# EAGLE design soic8 (EAGLE 7.7.0)
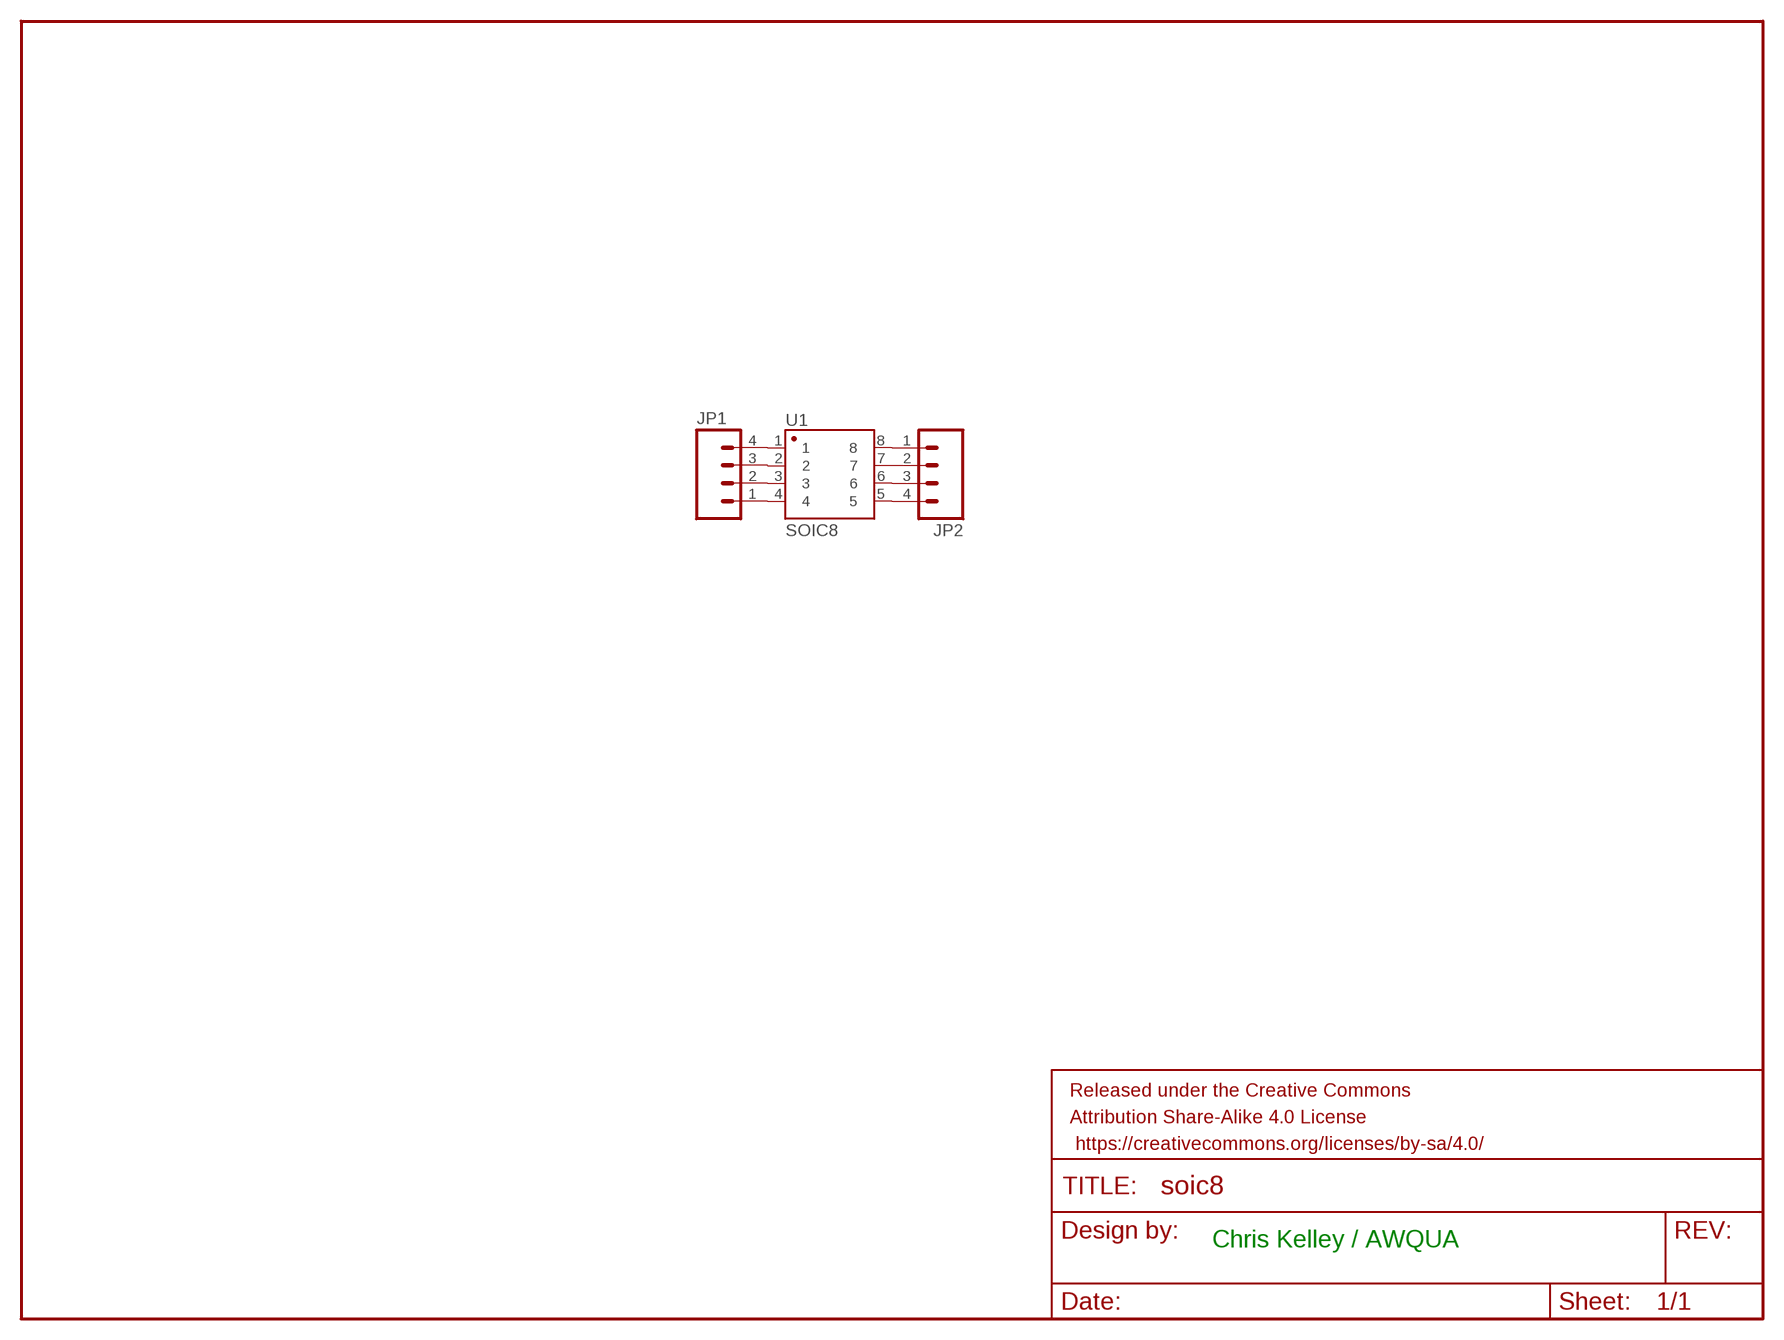
[diagram p0: schematic, sheet 1]

## Parts
FRAME1  FRAME-LETTER  [CREATIVE_COMMONS]
JP1  M04PTH  [1X04]
JP2  M04PTH  [1X04]
U1  SOIC8  GENERIC-SOIC8  [SO08-UNIVERSAL]

## Nets
N$1: JP1.1 U1.4
N$2: JP1.2 U1.3
N$3: JP1.3 U1.2
N$4: JP1.4 U1.1
N$5: JP2.1 U1.8
N$6: JP2.2 U1.7
N$7: JP2.3 U1.6
N$8: JP2.4 U1.5

## Notes on the sheet
- Chris Kelley / AWQUA

## Library data of the parts
FRAME1 = SparkFun-Aesthetics:FRAME-LETTER: Schematic Frame Standard 8.5x11 US Letter frame
JP1 JP2 = SparkFun-Connectors:M04: Header 4 Standard 4-pin 0.1" header. Use with straight break away headers (SKU : PRT-00116), right angle break away headers (PRT-00553), swiss pins (PRT-00743), machine pins (PRT-00117), and female headers (PRT-00115). Molex polarized connector foot print use with SKU : PRT-08231 with associated crimp pins and housings. 1MM SMD Version SKU: PRT-10208
U1 = SparkFun-AnalogIC:GENERIC-SOIC8: A placeholder for generic narrow & wide SOIC8 foorptints - used on the DIP adapter board.

## Board
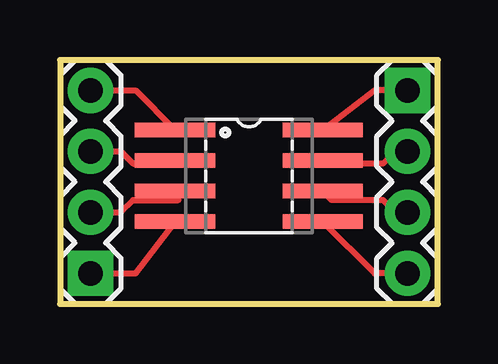
[diagram p1: board, top side]

Size 15.75 x 10.16 mm. Coordinates in mm from the lower left corner, seen from the top.
Outline: 0,0 15.75,0 15.75,10.16 0,10.16 0,0
Copper layers (1*16): Top 0.035mm / dielectric 1.5mm / Bottom 0.035mm
Design rules "default *": minimum track width 10mil, minimum drill 24mil, track to track 8mil, track to pad 8mil, pad to pad 8mil, via to via 8mil, smd to smd 8mil, copper to edge 40mil, drill to drill 8mil, minimum pad ring 10mil, minimum via ring 8mil, stop-mask expansion 4mil, vias tented up to drill 13mil, thermal gap 10mil

### Footprints (pad centres in the part's own frame; a part is rotated, then mirrored left to right if it is on the bottom)
1X04 = drill 1.016 pad 1.88 square: 1 0,0 | drill 1.016 pad 1.88: 2 2.54,0; 3 5.08,0; 4 7.62,0
SO08-UNIVERSAL = smd 0.61 x 3.353: 1 -1.905,-3.073; 2 -0.635,-3.073; 3 0.635,-3.073; 4 1.905,-3.073; 5 1.905,3.073; 6 0.635,3.073; 7 -0.635,3.073; 8 -1.905,3.073

### Placement (x,y rotation side)
FRAME1  16.51,-15.24 0 top  (outside the outline)
JP1  1.27,1.27 90 top
JP2  14.48,8.89 270 top
U1  7.87,5.33 270 top

### Tracks (layer width: path | path; a pad name or v marks a point on that pad's centre or on a via)
N$1
  Top 0.254: JP1.1 3.15,1.27 U1.4
N$2
  Top 0.254: JP1.2 2.54,3.81 3.05,4.32 4.93,4.32 U1.3
N$3
  Top 0.254: JP1.3 2.54,6.35 3.05,5.84 4.93,5.84 U1.2
N$4
  Top 0.254: JP1.4 3.15,8.89 U1.1
N$5
  Top 0.254: JP2.1 13.11,8.89 U1.8
N$6
  Top 0.254: JP2.2 13.97,6.35 13.46,5.84 11.33,5.84 U1.7
N$7
  Top 0.254: JP2.3 13.97,3.81 13.46,4.32 11.33,4.32 U1.6
N$8
  Top 0.254: JP2.4 13.11,1.27 U1.5

### Text on the board
tPlace: Chris Kelley / AWQUA